# EAGLE design Nodo_univ (EAGLE 6.5.0)
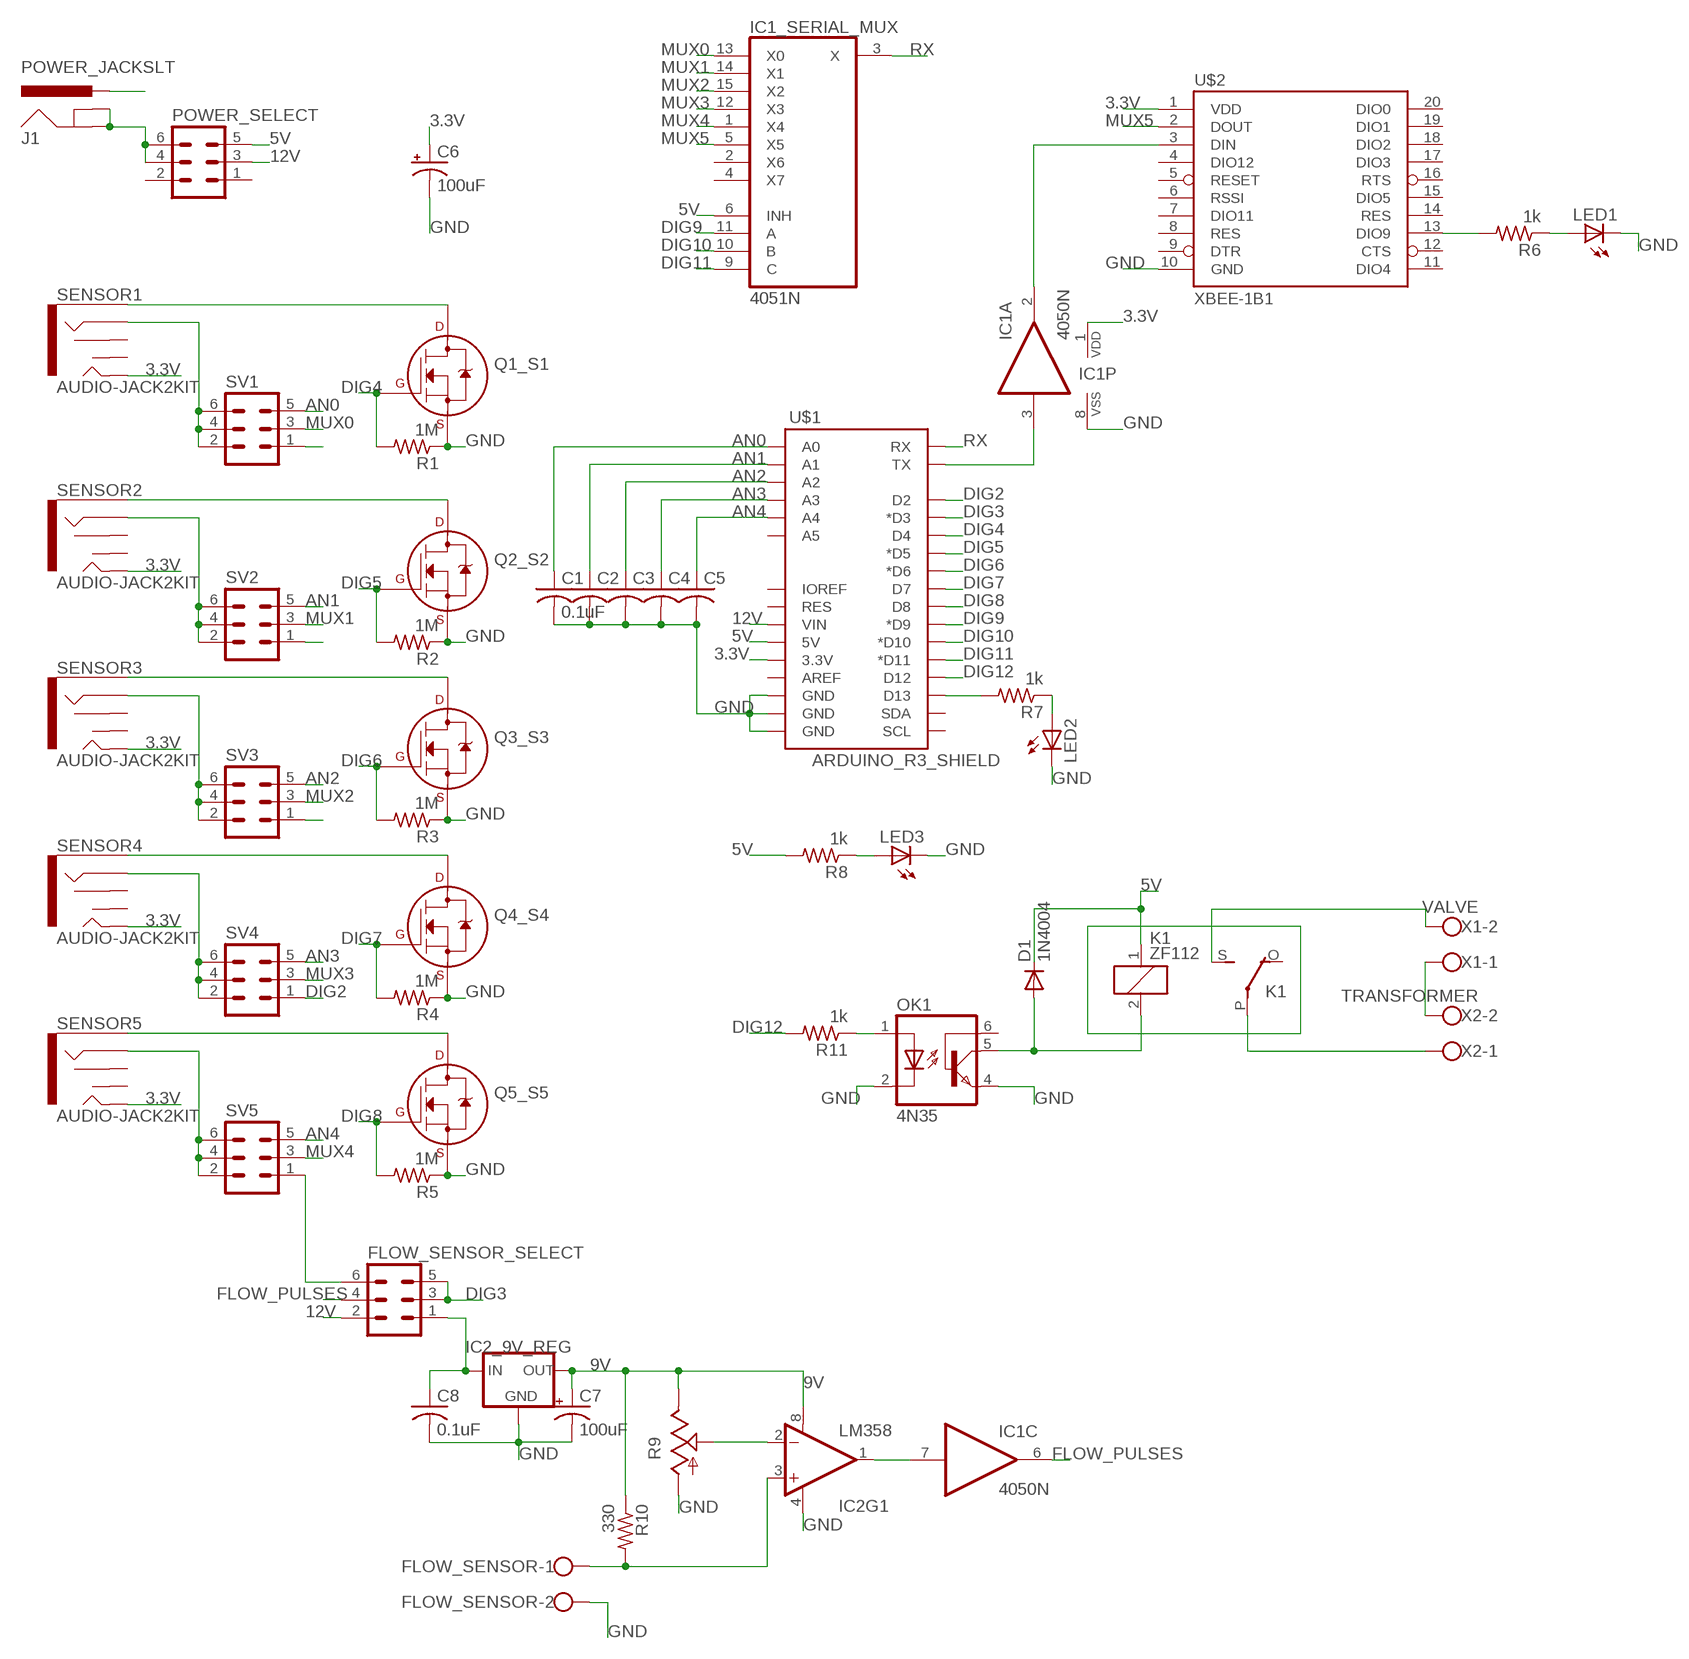
[diagram p0: schematic, sheet 1]

## Parts
C1  0.1uF  C-US025-025X050  [C025-025X050]
C2  C-US025-025X050  [C025-025X050]
C3  C-US025-025X050  [C025-025X050]
C4  C-US025-025X050  [C025-025X050]
C5  C-US025-025X050  [C025-025X050]
C6  100uF  CAP_POLPTH1  [CPOL-RADIAL-100UF-25V]
C7  100uF  CAP_POLPTH1  [CPOL-RADIAL-100UF-25V]
C8  0.1uF  C-US025-025X050  [C025-025X050]
D1  1N4004  [DO41-10]
FLOW_SENSOR  W237-102  [W237-102]
FLOW_SENSOR_SELECT  MA03-2  [MA03-2]
IC1  4050N  [DIL16]
IC1_SERIAL_MUX  4051N  [DIL16]
IC2  LM358  [DIP08]
IC2_9V_REG  78XXL  [78XXL]
J1  POWER_JACKSLT  [POWER_JACK_SLOT]
K1  ZF112  [ZF112]
LED1  LED3MM  [LED3MM]
LED2  LED3MM  [LED3MM]
LED3  LED3MM  [LED3MM]
OK1  4N35  [DIL06]
POWER_SELECT  MA03-2  [MA03-2]
Q1_S1  2N7000_TO92  [TO-92]
Q2_S2  2N7000_TO92  [TO-92]
Q3_S3  2N7000_TO92  [TO-92]
Q4_S4  2N7000_TO92  [TO-92]
Q5_S5  2N7000_TO92  [TO-92]
R1  1M  R-US_0207/10  [0207/10]
R2  1M  R-US_0207/10  [0207/10]
R3  1M  R-US_0207/10  [0207/10]
R4  1M  R-US_0207/10  [0207/10]
R5  1M  R-US_0207/10  [0207/10]
R6  1k  R-US_0207/10  [0207/10]
R7  1k  R-US_0207/10  [0207/10]
R8  1k  R-US_0207/10  [0207/10]
R9  TRIM_US-B64Y  [B64Y]
R10  330  R-US_0207/10  [0207/10]
R11  1k  R-US_0207/10  [0207/10]
SENSOR1  AUDIO-JACK2KIT  [AUDIO-JACK-KIT]
SENSOR2  AUDIO-JACK2KIT  [AUDIO-JACK-KIT]
SENSOR3  AUDIO-JACK2KIT  [AUDIO-JACK-KIT]
SENSOR4  AUDIO-JACK2KIT  [AUDIO-JACK-KIT]
SENSOR5  AUDIO-JACK2KIT  [AUDIO-JACK-KIT]
SV1  MA03-2  [MA03-2]
SV2  MA03-2  [MA03-2]
SV3  MA03-2  [MA03-2]
SV4  MA03-2  [MA03-2]
SV5  MA03-2  [MA03-2]
U$1  ARDUINO_R3_SHIELD  [UNO_R3_SHIELD]
U$2  XBEE-1B1  [XBEE-1]
X1  VALVE  W237-102  [W237-102]
X2  TRANSFORMER  W237-102  [W237-102]

## Nets
3.3V: C6.1(+) IC1.1(P:VDD) SENSOR1.TIP SENSOR2.TIP SENSOR3.TIP SENSOR4.TIP SENSOR5.TIP U$1.3.3V U$2.1(VDD)
5V: D1.C IC1_SERIAL_MUX.6(INH) K1.1 POWER_SELECT.5 R8.2 U$1.5V
9V: C7.1(+) IC2.8(V+) IC2_9V_REG.OUT R9.E R10.1
12V: FLOW_SENSOR_SELECT.2 POWER_SELECT.3 U$1.VIN
AN0: C1.1 SV1.5 U$1.A0
AN1: C2.1 SV2.5 U$1.A1
AN2: C3.1 SV3.5 U$1.A2
AN3: C4.1 SV4.5 U$1.A3
AN4: C5.1 SV5.5 U$1.A4
DIG2: SV4.1 U$1.D2
DIG3: FLOW_SENSOR_SELECT.3 FLOW_SENSOR_SELECT.5 U$1.D3(*D3)
DIG4: Q1_S1.2(G) R1.2 U$1.D4
DIG5: Q2_S2.2(G) R2.2 U$1.D5(*D5)
DIG6: Q3_S3.2(G) R3.2 U$1.D6(*D6)
DIG7: Q4_S4.2(G) R4.2 U$1.D7
DIG8: Q5_S5.2(G) R5.2 U$1.D8
DIG9: IC1_SERIAL_MUX.11(A) U$1.D9(*D9)
DIG10: IC1_SERIAL_MUX.10(B) U$1.D10(*D10)
DIG11: IC1_SERIAL_MUX.9(C) U$1.D11(*D11)
DIG12: R11.2 U$1.D12
FLOW_PULSES: FLOW_SENSOR_SELECT.4 IC1.6(C:O)
GND: C1.2 C2.2 C3.2 C4.2 C5.2 C6.2(-) C7.2(-) C8.2 FLOW_SENSOR.2 IC1.8(P:VSS) IC2.4(V-) IC2_9V_REG.GND J1.PWR LED1.K(C) LED2.K(C) LED3.K(C) OK1.2(C) OK1.4(EMI) Q1_S1.1(S) Q2_S2.1(S) Q3_S3.1(S) Q4_S4.1(S) Q5_S5.1(S) R1.1 R2.1 R3.1 R4.1 R5.1 R9.A U$1.GND@0(GND) U$1.GND@1(GND) U$1.GND@2(GND) U$2.10(GND)
MUX0: IC1_SERIAL_MUX.13(X0) SV1.3
MUX1: IC1_SERIAL_MUX.14(X1) SV2.3
MUX2: IC1_SERIAL_MUX.15(X2) SV3.3
MUX3: IC1_SERIAL_MUX.12(X3) SV4.3
MUX4: IC1_SERIAL_MUX.1(X4) SV5.3
MUX5: IC1_SERIAL_MUX.5(X5) U$2.2(DOUT)
N$1: Q1_S1.3(D) SENSOR1.SLEEVE
N$2: Q2_S2.3(D) SENSOR2.SLEEVE
N$3: Q3_S3.3(D) SENSOR3.SLEEVE
N$4: Q4_S4.3(D) SENSOR4.SLEEVE
N$5: Q5_S5.3(D) SENSOR5.SLEEVE
N$6: SENSOR1.RING SV1.2 SV1.4 SV1.6
N$7: SENSOR2.RING SV2.2 SV2.4 SV2.6
N$8: SENSOR3.RING SV3.2 SV3.4 SV3.6
N$9: SENSOR4.RING SV4.2 SV4.4 SV4.6
N$10: SENSOR5.RING SV5.2 SV5.4 SV5.6
N$11: FLOW_SENSOR_SELECT.6 SV5.1
N$12: IC1.3(A:I) U$1.TX
N$13: SV1.1
N$14: IC1.2(A:O) U$2.3(DIN)
N$15: R6.2 U$2.13(DIO9)
N$16: SV2.1
N$17: LED1.A R6.1
N$18: R7.2 U$1.D13
N$19: SV3.1
N$20: LED2.A R7.1
N$21: C8.1 FLOW_SENSOR_SELECT.1 IC2_9V_REG.IN
N$22: IC2.2(-IN) R9.S
N$23: LED3.A R8.1
N$24: J1.GND@1(GNDBREAK) J1.GND@2(GND) POWER_SELECT.4 POWER_SELECT.6
N$25: IC1.7(C:I) IC2.1(OUT)
N$26: FLOW_SENSOR.1 IC2.3(+IN) R10.2
N$27: OK1.1(A) R11.1
N$29: D1.A K1.2 OK1.5(COL)
N$30: X1.1 X2.2
N$31: K1.P(2:P) X2.1
N$32: K1.S(2:S) X1.2
RX: IC1_SERIAL_MUX.3(X) U$1.RX
Unconnected: IC1.4(B:O) IC1.5(B:I) IC1.9(D:I) IC1.10(D:O) IC1.11(E:I) IC1.12(E:O) IC1.14(F:I) IC1.15(F:O) IC1_SERIAL_MUX.2(X6) IC1_SERIAL_MUX.4(X7) IC2.5(+IN) IC2.6(-IN) IC2.7(OUT) K1.O(2:O) OK1.6(BAS) POWER_SELECT.1 POWER_SELECT.2 SENSOR1.RSH SENSOR1.TSH SENSOR2.RSH SENSOR2.TSH SENSOR3.RSH SENSOR3.TSH SENSOR4.RSH SENSOR4.TSH SENSOR5.RSH SENSOR5.TSH U$1.A5 U$1.AREF U$1.IOREF U$1.RES U$1.SCL U$1.SDA U$2.4(DIO12) U$2.5(RESET) U$2.6(RSSI) U$2.7(DIO11) U$2.8(RES) U$2.9(DTR) U$2.11(DIO4) U$2.12(CTS) U$2.14(RES) U$2.15(DIO5) U$2.16(RTS) U$2.17(DIO3) U$2.18(DIO2) U$2.19(DIO1) U$2.20(DIO0)

## Power pins joined to a net without a drawn wire
GND: IC1_SERIAL_MUX.8(GND)
VCC: IC1_SERIAL_MUX.16(VCC)
VEE: IC1_SERIAL_MUX.7(VEE)

## Library data of the parts
C1-C5 C8 = resistor:C-US: CAPACITOR, American symbol
C6 C7 = SparkFun-Capacitors:CAP_POL: Capacitor Polarized These are standard SMD and PTH capacitors. Normally 10uF, 47uF, and 100uF in electrolytic and tantalum varieties. Always verify the external diameter of the through hole cap, it varies with capacity, voltage, and manufacturer. The EIA devices should be standard.
D1 = diode:1N4004: DIODE general purpose rectifier, 1 A
FLOW_SENSOR X1 X2 = con-wago-500:W237-102: WAGO SCREW CLAMP; MPN: 237-102; OC_FARNELL: unknown; OC_NEWARK: 70K9898
FLOW_SENSOR_SELECT POWER_SELECT SV1-SV5 = con-lstb:MA03-2: PIN HEADER; OC_FARNELL: unknown; OC_NEWARK: unknown
IC1 = 40xx:4050: Hex non-inverting BUFFER
IC1_SERIAL_MUX = 40xx:4051: 8-channel ANALOG MULTIPLEXER
IC2 = SparkFun-AnalogIC:LM358: Jellybean op-amp; PROD_ID: IC-09172
IC2_9V_REG = v-reg:78XXL: VOLTAGE REGULATOR
J1 = SparkFun-Connectors:POWER_JACK: Power Jack This is the standard 5.5mm barrel jack for power. The PTH is the most common, proven, reliable, footprint. The Slot footprint only works if the mill layer is transmitted to the PCB fab house so be warned. Mating wall wart : TOL-00298 (and others); PROD_ID: PRT-00119
K1 = relay:ZF112: RELAY 1 x switch; OC_FARNELL: unknown; OC_NEWARK: unknown
LED1-LED3 = led:LED: LED OSRAM: - CHIPLED LG R971, LG N971, LY N971, LG Q971, LY Q971, LO R971, LY R971 LH N974, LH R974 LS Q976, LO Q976, LY Q976 LO Q996 - Hyper CHIPLED LW Q18S LB Q993, LB Q99A, LB R99A - SideLED LS A670, LO A670, LY A670, LG A670, LP A670 LB A673, LV A673, LT A673, LW A673 LH A674 LY A675 LS A676, LA A676, LO A676, LY A676, LW A676 LS A679, LY A679, LG A679 - Hyper Micro SIDELED® LS Y876, LA Y876, LO Y876, LY Y876 LT Y87S - SmartLED LW L88C, LW L88S LB L89C, LB L89S, LG L890 LS L89K, LO L89K, LY L89K LS L896, LA L896, LO L896, LY L896 - TOPLED LS T670, LO T670, LY T670, LG T670, LP T670 LSG T670, LSP T670, LSY T670, LOP T670, LYG T670 LG T671, LOG T671, LSG T671 LB T673, LV T673, LT T673, LW T673 LH T674 LS T676, LA T676, LO T676, LY T676, LB T676, LH T676, LSB T676, LW T676 LB T67C, LV T67C, LT T67C, LS T67K, LO T67K, LY T67K, LW E67C LS E67B, LA E67B, LO E67B, LY E67B, LB E67C, LV E67C, LT E67C LW T67C LS T679, LY T679, LG T679 LS T770, LO T770, LY T770, LG T770, LP T770 LB T773, LV T773, LT T773, LW T773 LH T774 LS E675, LA E675, LY E675, LS T675 LS T776, LA T776, LO T776, LY T776, LB T776 LHGB T686 LT T68C, LB T68C - Hyper Mini TOPLED® LB M676 - Mini TOPLED Santana® LG M470 LS M47K, LO M47K, LY M47K Source: http://www.osram.convergy.de LUXEON: - LUMILED® LXK2-PW12-R00, LXK2-PW12-S00, LXK2-PW14-U00, LXK2-PW14-V00 LXK2-PM12-R00, LXK2-PM12-S00, LXK2-PM14-U00 LXK2-PE12-Q00, LXK2-PE12-R00, LXK2-PE12-S00, LXK2-PE14-T00, LXK2-PE14-U00 LXK2-PB12-K00, LXK2-PB12-L00, LXK2-PB12-M00, LXK2-PB14-N00, LXK2-PB14-P00, LXK2-PB14-Q00 LXK2-PR12-L00, LXK2-PR12-M00, LXK2-PR14-Q00, LXK2-PR14-R00 LXK2-PD12-Q00, LXK2-PD12-R00, LXK2-PD12-S00 LXK2-PH12-R00, LXK2-PH12-S00 LXK2-PL12-P00, LXK2-PL12-Q00, LXK2-PL12-R00 Source: www.luxeon.com KINGBRIGHT: KA-3528ASYC Source: www.kingbright.com
OK1 = optocoupler:4N35: MOTOROLA OPTO COUPLER; MF: FAIRCHILD SEMICONDUCTOR; MPN: 4N35; OC_FARNELL: 1328375; OC_NEWARK: 72K9946
Q1_S1 Q2_S2 Q3_S3 Q4_S4 Q5_S5 = transistors:2N700*: 2N7000, 2N7002, NDS7002A N-channel enhancement mode MOSFET
R1-R8 R10 R11 = resistor:R-US_: RESISTOR, American symbol
R9 = pot:TRIM_US-: POTENTIOMETER
SENSOR1-SENSOR5 = SparkFun-Connectors:AUDIO-JACK2: Stereo audio jack with bypass switches. SMT version used on LilyPad MP3 board.; PROD_ID: CONN-08774
U$1 = SparkFun-Boards:ARDUINO_R3_SHIELD: Shield form compatible with the Arduino Uno R3.
U$2 = SparkFun-RF:XBEE-1: Xbee module footprints SMT header is CONN-09042.

## Board
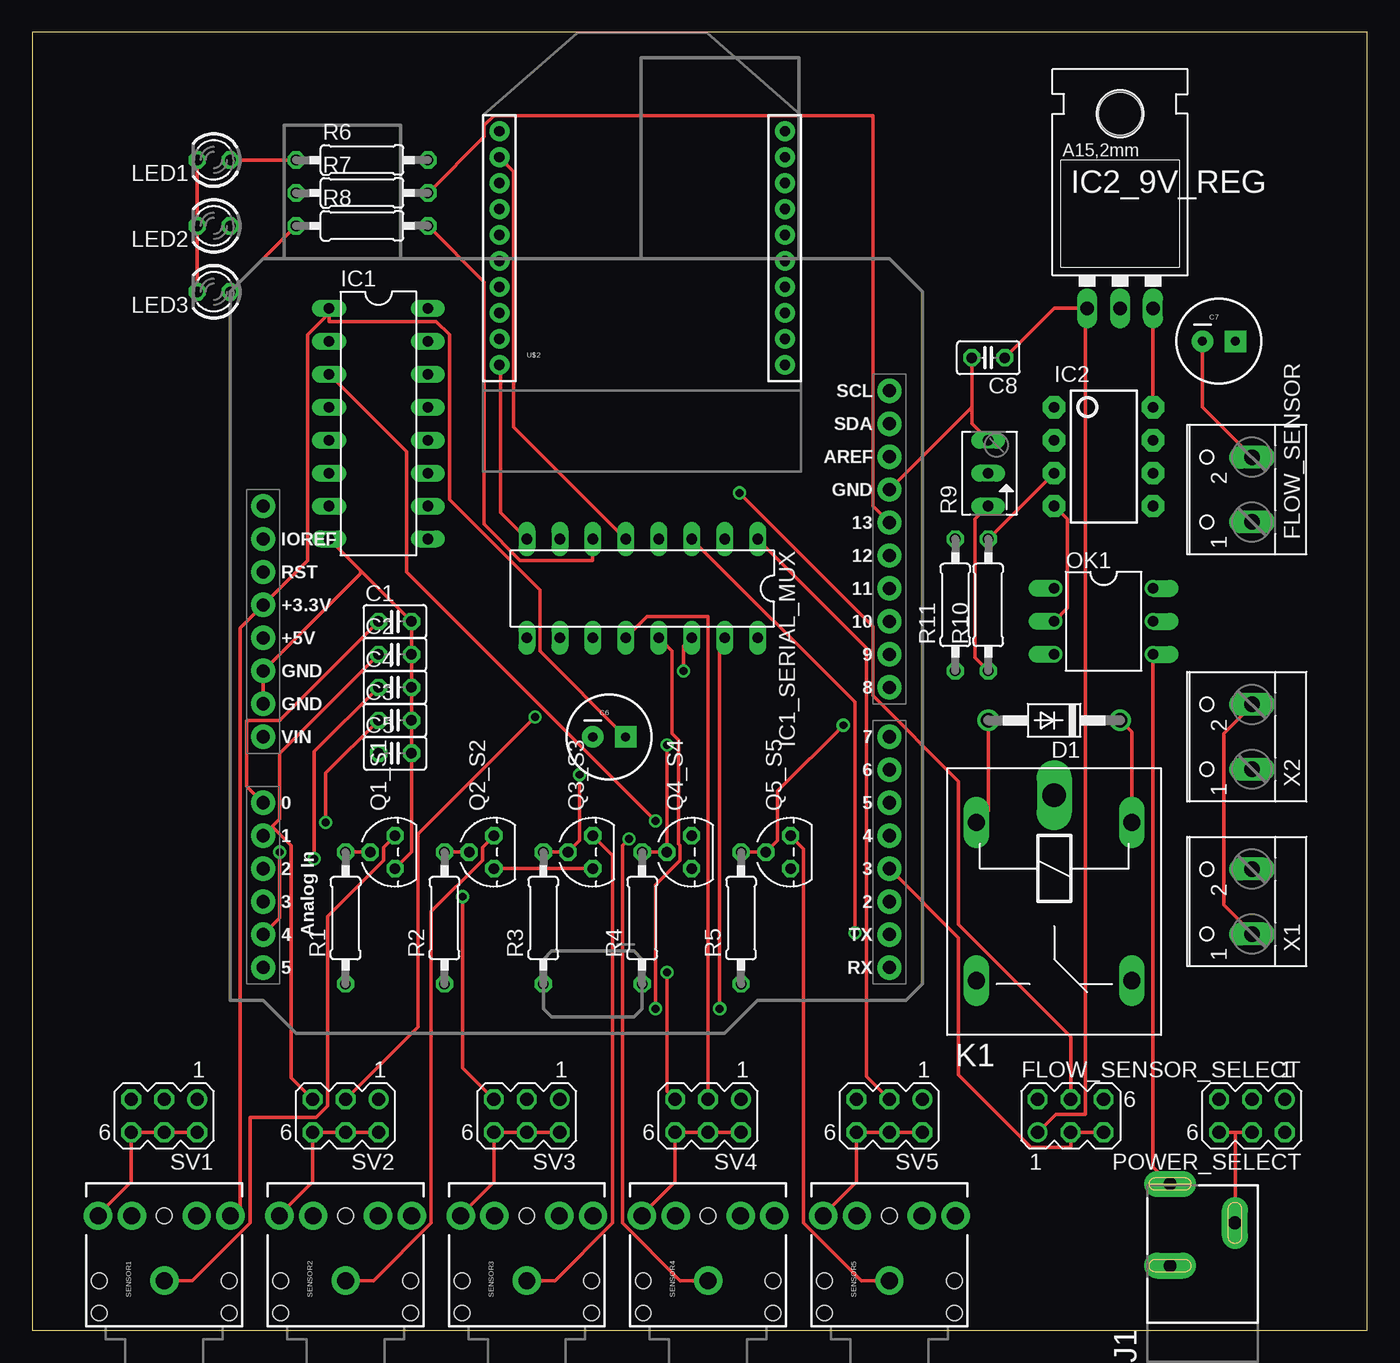
[diagram p1: board, top side]
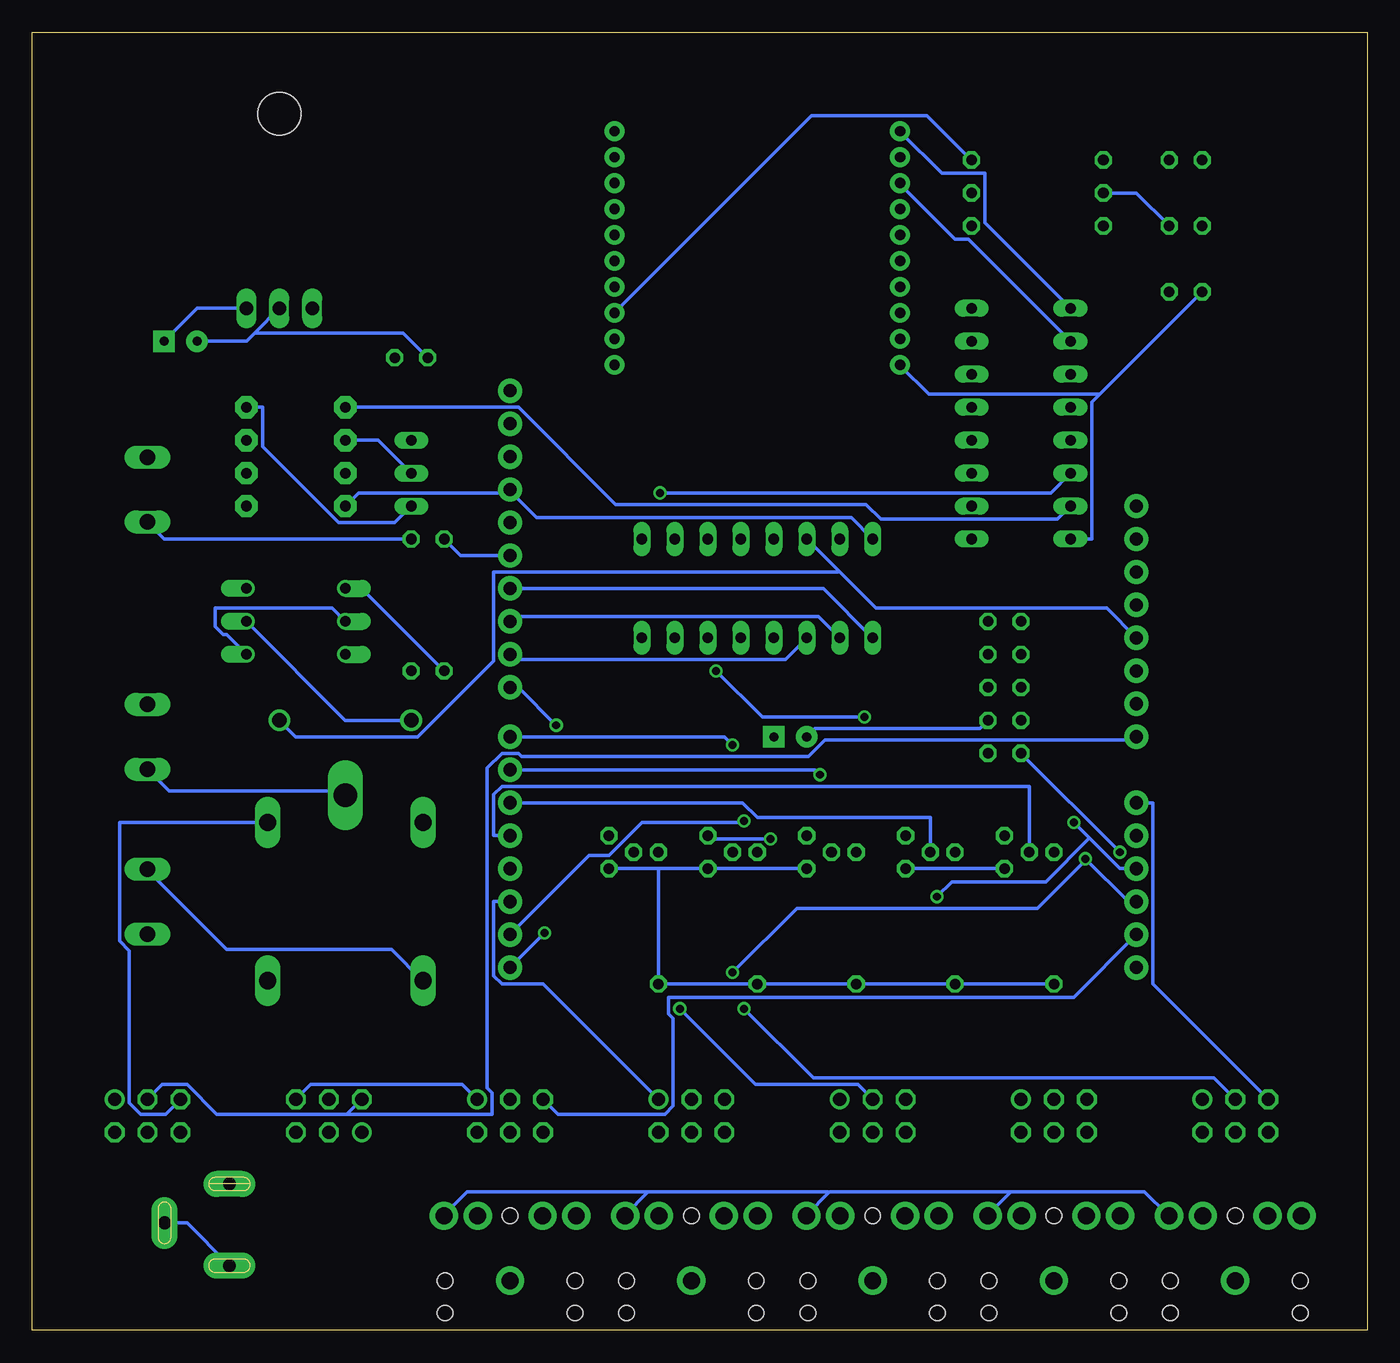
[diagram p2: board, bottom side, seen from below]

Size 102.85 x 100 mm. Coordinates in mm from the lower left corner, seen from the top.
Outline: 0,0 102.85,0 102.85,100 0,100 0,0
Copper layers (1*16): Top 0.035mm / dielectric 1.5mm / Bottom 0.035mm
Design rules "default": minimum track width 10mil, minimum drill 24mil, track to track 8mil, track to pad 8mil, pad to pad 8mil, via to via 8mil, smd to smd 8mil, copper to edge 40mil, drill to drill 8mil, minimum pad ring 10mil, minimum via ring 8mil, stop-mask expansion 4mil, vias tented up to drill 0mil, thermal gap 10mil

### Footprints (pad centres in the part's own frame; a part is rotated, then mirrored left to right if it is on the bottom)
C025-025X050 = drill 0.813 octagon: 1 -1.27,0; 2 1.27,0
CPOL-RADIAL-100UF-25V = drill 0.7 pad 1.651 square: 1 1.27,0 | drill 0.7 pad 1.651: 2 -1.27,0
DO41-10 = drill 1.118: A 5.08,0; C -5.08,0
W237-102 = drill 1.194 long: 1 -2.5,-1.27; 2 2.5,-1.27
MA03-2 = drill 1.016: 1 -2.54,-1.27 | drill 1.016 octagon: 2 -2.54,1.27; 3 0,-1.27; 4 0,1.27; 5 2.54,-1.27; 6 2.54,1.27
DIL16 = drill 0.813 long: 1 -8.89,-3.81; 2 -6.35,-3.81; 3 -3.81,-3.81; 4 -1.27,-3.81; 5 1.27,-3.81; 6 3.81,-3.81; 7 6.35,-3.81; 8 8.89,-3.81; 9 8.89,3.81; 10 6.35,3.81; 11 3.81,3.81; 12 1.27,3.81; 13 -1.27,3.81; 14 -3.81,3.81; 15 -6.35,3.81; 16 -8.89,3.81
DIP08 = drill 0.813 pad 1.727 octagon: 1 -3.81,-3.81; 2 -1.27,-3.81; 3 1.27,-3.81; 4 3.81,-3.81; 5 3.81,3.81; 6 1.27,3.81; 7 -1.27,3.81; 8 -3.81,3.81
78XXL = drill 1.016 long: GND 0,-3.81; IN -2.54,-3.81; OUT 2.54,-3.81 | hole 3.302: 0,11.176
POWER_JACK_SLOT = drill 1 pad 2 long: GND@1 2.58,7.5; GND@2 7.58,10.8; PWR 2.58,13.8
ZF112 = drill 1.321 long: 1 -6.096,5.994; 2 -6.096,-5.994; O 6.096,5.994; S 6.096,-5.994 | drill 1.803 long: P -8.204,0
LED3MM = drill 0.813 octagon: A -1.27,0; K 1.27,0
DIL06 = drill 0.813 offset: 1 -2.54,-3.81; 2 0,-3.81; 3 2.54,-3.81; 4 2.54,3.81; 5 0,3.81; 6 -2.54,3.81
TO-92 = drill 0.813 octagon: 1 -1.27,0; 2 0,1.905; 3 1.27,0
0207/10 = drill 0.813 octagon: 1 -5.08,0; 2 5.08,0
B64Y = drill 0.813 long: A 2.54,0; E -2.54,0; S 0,0
AUDIO-JACK-KIT = drill 1.3 pad 2.184: RING 5,5.1; RSH 5,2.5; SLEEVE 0,0; TIP 5,-5.1; TSH 5,-2.5 | hole 1.2: 0,5; -2.5,5; -2.5,-5; 0,-5; 5,0
UNO_R3_SHIELD = drill 1.016 pad 1.88: 3.3V 50.8,26.67; 5V 50.8,29.21; A0 50.8,41.91; A1 50.8,44.45; A2 50.8,46.99; A3 50.8,49.53; A4 50.8,52.07; A5 50.8,54.61; AREF 2.54,15.24; D2 2.54,49.53; D3 2.54,46.99; D4 2.54,44.45; D5 2.54,41.91; D6 2.54,39.37; D7 2.54,36.83; D8 2.54,33.02; D9 2.54,30.48; D10 2.54,27.94; D11 2.54,25.4; D12 2.54,22.86; D13 2.54,20.32; GND@0 50.8,31.75; GND@1 50.8,34.29; GND@2 2.54,17.78; IOREF 50.8,21.59; NC 50.8,19.05; RES 50.8,24.13; RX 2.54,54.61; SCL 2.54,10.16; SDA 2.54,12.7; TX 2.54,52.07; VIN 50.8,36.83
XBEE-1 = drill 0.8 pad 1.524: 1 -11,20; 2 -11,18; 3 -11,16; 4 -11,14; 5 -11,12; 6 -11,10; 7 -11,8; 8 -11,6; 9 -11,4; 10 -11,2; 11 11,2; 12 11,4; 13 11,6; 14 11,8; 15 11,10; 16 11,12; 17 11,14; 18 11,16; 19 11,18; 20 11,20

### Placement (x,y rotation side)
C1  27.94,54.61 0 top
C2  27.94,52.07 0 top
C3  27.94,46.99 0 top
C4  27.94,49.53 0 top
C5  27.94,44.45 0 top
C6  44.45,45.72 0 top
C7  91.44,76.2 0 top
C8  73.66,74.93 180 top
D1  78.74,46.99 180 top
FLOW_SENSOR  92.71,64.77 90 top
FLOW_SENSOR_SELECT  80.01,16.51 0 top
IC1  26.67,69.85 270 top
IC1_SERIAL_MUX  46.99,57.15 180 top
IC2  82.55,67.31 270 top
IC2_9V_REG  83.82,82.55 0 top
J1  85.09,-2.54 0 top
K1  78.74,33.02 270 top
LED1  13.97,90.17 180 top
LED2  13.97,85.09 180 top
LED3  13.97,80.01 180 top
OK1  82.55,54.61 270 top
POWER_SELECT  93.98,16.51 180 top
Q1_S1  27.94,36.83 90 top
Q2_S2  35.56,36.83 90 top
Q3_S3  43.18,36.83 90 top
Q4_S4  50.8,36.83 90 top
Q5_S5  58.42,36.83 90 top
R1  24.13,31.75 90 top
R2  31.75,31.75 90 top
R3  39.37,31.75 90 top
R4  46.99,31.75 90 top
R5  54.61,31.75 90 top
R6  25.4,90.17 0 top
R7  25.4,87.63 0 top
R8  25.4,85.09 0 top
R9  73.66,66.04 90 top
R10  73.66,55.88 90 top
R11  71.12,55.88 90 top
SENSOR1  10.16,3.81 90 top
SENSOR2  24.13,3.81 90 top
SENSOR3  38.1,3.81 90 top
SENSOR4  52.07,3.81 90 top
SENSOR5  66.04,3.81 90 top
SV1  10.16,16.51 180 top
SV2  24.13,16.51 180 top
SV3  38.1,16.51 180 top
SV4  52.07,16.51 180 top
SV5  66.04,16.51 180 top
U$1  68.58,82.55 180 top
U$2  46.99,72.39 0 top
X1  92.71,33.02 90 top
X2  92.71,45.72 90 top

### Tracks (layer width: path | path; a pad name or v marks a point on that pad's centre or on a via)
3.3V
  Top 0.254: C6.1 39.12,52.32 39.12,57.02 32.13,64.01 32.13,76.71 31.12,77.72 22.86,77.72 22.86,78.36 | 22.86,78.36 21.21,76.71 21.21,59.31 U$1.3.3V 16,54.1 16,9.53 15.37,8.89 SENSOR1.TIP | 22.86,78.36 IC1.1
  Bottom 0.254: 27.5,10.6 29.21,8.89 SENSOR2.TIP | 27.5,10.6 27.43,10.67 17.14,10.67 15.37,8.89 SENSOR1.TIP | 41.47,10.6 41.4,10.67 27.56,10.67 27.5,10.6 | 41.47,10.6 43.18,8.89 SENSOR3.TIP | 55.44,10.6 55.37,10.67 41.53,10.67 41.47,10.6 | 55.44,10.6 57.15,8.89 SENSOR4.TIP | SENSOR5.TIP 71.12,8.89 69.34,10.67 55.5,10.67 55.44,10.6 | IC1.1 29.46,85.34 29.46,89.15 32.77,89.15 35.94,92.33 U$2.1
5V
  Top 0.254: D1.C 84.71,46.1 84.71,39.12 K1.1 | R8.2 34.8,80.77 34.8,62.1 37.59,59.31 43.18,59.31 IC1_SERIAL_MUX.6
  Bottom 0.254: POWER_SELECT.5 92.58,16.64 94.49,16.64 95.38,17.53 95.38,29.21 96.14,29.97 96.14,39.12 K1.1 | 40.7,58.48 37.85,55.63 20.07,55.63 U$1.5V | 40.7,58.48 IC1_SERIAL_MUX.6 | D1.C 82.55,45.72 73.15,45.72 67.31,51.56 67.31,58.42 40.77,58.42 40.7,58.48
9V
  Top 0.254: R10.1 72.64,51.82 72.64,62.48 R9.E | IC2.8 IC2_9V_REG.OUT
  Bottom 0.254: C7.1 90.17,78.74 IC2_9V_REG.OUT | R9.E 74.93,62.23 79.25,62.23 85.09,68.07 85.09,71.12 IC2.8
12V
  Bottom 0.254: 78.55,16.7 78.61,16.64 88.65,16.64 90.93,18.92 92.84,18.92 POWER_SELECT.3 | 78.55,16.7 FLOW_SENSOR_SELECT.2 | U$1.VIN 18.03,45.47 41.78,45.47 43.05,44.2 65.15,44.2 65.41,44.45 66.67,44.45 67.82,43.31 67.82,18.67 67.44,18.29 67.44,16.64 78.49,16.64 78.55,16.7
AN0
  Top 0.254: C1.1 19.05,46.99 16.51,46.99 16.51,41.91 U$1.A0
  Bottom 0.254: SV1.5 16.51,26.67 16.51,40.64 U$1.A0
AN1
  Top 0.254: C2.1 19.05,44.45 19.05,39.37 18.48,38.8 | U$1.A1 18.48,38.8 | SV2.5 19.94,19.43 19.94,37.34 18.48,38.8
AN2  (via drill 0.61)
  Top 0.254: C3.1 22.61,42.93 v22.61,39.12 | SV3.5 33.15,20.19 v33.15,33.4
  Bottom 0.254: 21.4,37.91 19.05,35.56 U$1.A2 | 21.4,37.91 v22.61,39.12 | v33.15,33.4 32,34.54 24.77,34.54 21.4,37.91
AN3  (via drill 0.61)
  Top 0.254: C4.1 21.72,44.58 v21.72,36.32 | SV4.5 48.89,18.41 v48.89,27.56
  Bottom 0.254: U$1.A3 18.41,33.02 v21.72,36.32 21.72,36.2 25.4,32.51 43.94,32.51 v48.89,27.56
AN4  (via drill 0.61)
  Top 0.254: v19.05,36.83 19.05,31.75 U$1.A4
  Bottom 0.254: v19.05,36.83 C5.1 | SV5.5 62.36,16.64 54.1,16.64 53.47,17.27 53.47,24 53.85,24.38 53.85,25.65 22.61,25.65 U$1.A4
DIG2
  Bottom 0.254: SV4.1 63.5,26.67 66.67,26.67 67.31,27.3 67.31,33.02 U$1.D2
DIG3
  Top 0.254: FLOW_SENSOR_SELECT.5 FLOW_SENSOR_SELECT.3 80.01,14.1 76.96,14.1 71.37,19.68 71.37,30.23 U$1.D3
DIG4
  Top 0.254: Q1_S1.2 R1.2
  Bottom 0.254: Q1_S1.2 26.04,41.91 66.67,41.91 67.31,41.27 67.31,38.1 U$1.D4
DIG5
  Top 0.254: Q2_S2.2 R2.2
  Bottom 0.254: Q2_S2.2 33.66,39.5 46.99,39.5 48.13,40.64 U$1.D5
DIG6  (via drill 0.61)
  Top 0.254: R3.2 Q3_S3.2 42.16,37.72 v42.16,42.8
  Bottom 0.254: v42.16,42.8 42.54,43.18 U$1.D6
DIG7  (via drill 0.61)
  Top 0.254: R4.2 Q4_S4.2 v48.89,45.09
  Bottom 0.254: v48.89,45.09 49.53,45.72 U$1.D7
DIG8  (via drill 0.61)
  Top 0.254: R5.2 Q5_S5.2 57.4,37.72 57.4,41.53 v62.48,46.61
  Bottom 0.254: v62.48,46.61 65.41,49.53 U$1.D8
DIG9
  Bottom 0.254: IC1_SERIAL_MUX.11 44.83,51.69 65.66,51.69 U$1.D9
DIG10
  Bottom 0.254: IC1_SERIAL_MUX.10 42.29,54.99 65.66,54.99 U$1.D10
DIG11
  Bottom 0.254: IC1_SERIAL_MUX.9 41.91,57.15 U$1.D11
DIG12
  Bottom 0.254: R11.2 69.85,59.69 U$1.D12
FLOW_PULSES  (via drill 0.61)
  Top 0.254: v54.48,64.52 64.77,54.23 64.77,48.9 71.37,42.29 71.37,31.24 80.01,22.61 FLOW_SENSOR_SELECT.4
  Bottom 0.254: IC1.6 24.38,64.52 v54.48,64.52
GND
  Top 0.254: R9.A 72.39,69.85 72.39,71.12 | C8.2 72.39,71.12 | 72.39,71.12 U$1.GND@2 | C7.2 90.17,71.12 93.98,67.31 FLOW_SENSOR.2 | OK1.2 79.76,55.63 79.76,62.48 IC2.4 | OK1.4 86.36,12.57 87.63,11.3 J1.PWR | Q2_S2.1 Q3_S3.1 | IC1_SERIAL_MUX.8 36.07,62.99 36.07,74.3 U$2.10 | LED3.K LED2.K LED1.K | U$1.GND@1 U$1.GND@0 25.27,58.29 25.27,58.42 25.34,58.48 | 25.34,58.48 C1.2 C2.2 C4.2 C3.2 C5.2 29.21,36.83 Q1_S1.1 | 25.34,58.48 IC1.8
  Bottom 0.254: 85.66,76.9 86.36,76.2 C7.2 | 85.66,76.9 IC2_9V_REG.GND | C8.2 74.3,76.83 85.6,76.83 85.66,76.9 | OK1.4 87.88,53.59 88.14,53.59 88.77,54.23 88.77,55.63 79.76,55.63 OK1.2 | IC2.4 77.72,64.52 66.29,64.52 U$1.GND@2 66.04,64.64 64.01,62.61 39.75,62.61 IC1_SERIAL_MUX.8 | R1.1 R2.1 R3.1 R4.1 R5.1 54.61,35.56 | Q2_S2.1 Q1_S1.1 | Q3_S3.1 Q4_S4.1 54.61,35.56 | 54.61,35.56 Q5_S5.1 | C6.2 42.54,46.35 29.85,46.35 C3.2 | 20.64,72.07 21.21,71.5 21.21,60.96 IC1.8 | 20.64,72.07 LED3.K | U$2.10 35.94,74.3 33.78,72.14 20.7,72.14 20.64,72.07
MUX0  (via drill 0.61)
  Top 0.254: IC1_SERIAL_MUX.13 49.28,52.32 49.28,45.97 49.78,45.47 49.78,37.47 49.91,37.34 49.91,36.2 48.01,34.29 v48.01,24.77
  Bottom 0.254: v48.01,24.77 42.67,19.43 11.81,19.43 SV1.3
MUX1  (via drill 0.61)
  Top 0.254: IC1_SERIAL_MUX.14 50.16,52.7 v50.16,50.8 | v38.73,47.24 29.72,38.23 29.72,23.37 SV2.3
  Bottom 0.254: v50.16,50.8 46.61,47.24 v38.73,47.24
MUX2  (via drill 0.61)
  Top 0.254: IC1_SERIAL_MUX.15 52.96,52.96 v52.96,24.77
  Bottom 0.254: v52.96,24.77 47.12,18.92 39.24,18.92 SV3.3
MUX3
  Top 0.254: IC1_SERIAL_MUX.12 47.37,54.99 52.07,54.99 SV4.3
MUX4
  Top 0.254: IC1_SERIAL_MUX.1 64.26,52.58 64.26,19.56 SV5.3
MUX5
  Top 0.254: IC1_SERIAL_MUX.5 37.08,69.6 37.08,89.28 36.07,90.3 U$2.2
N$1
  Top 0.254: Q1_S1.3 27.05,37.21 27.05,36.2 22.73,31.88 22.73,17.27 21.84,16.38 16.76,16.38 16.76,8.26 12.32,3.81 SENSOR1.SLEEVE
N$2
  Top 0.254: Q2_S2.3 34.67,37.21 34.67,36.2 30.73,32.26 30.73,8.26 26.29,3.81 SENSOR2.SLEEVE
N$3
  Top 0.254: Q3_S3.3 44.7,36.58 44.7,8.26 40.26,3.81 SENSOR3.SLEEVE
N$4  (via drill 0.61)
  Top 0.254: v45.97,37.85 45.47,37.34 45.47,8.26 49.91,3.81 SENSOR4.SLEEVE
  Bottom 0.254: Q4_S4.3 50.55,37.85 v45.97,37.85
N$5
  Top 0.254: Q5_S5.3 59.44,37.08 59.44,8.26 63.88,3.81 SENSOR5.SLEEVE
N$6
  Top 0.254: SV1.2 SV1.4 SV1.6 7.62,11.43 5.08,8.89 SENSOR1.RING
N$7
  Top 0.254: SV2.2 SV2.4 SV2.6 21.59,11.43 19.05,8.89 SENSOR2.RING
N$8
  Top 0.254: SV3.2 SV3.4 SV3.6 35.56,11.43 33.02,8.89 SENSOR3.RING
N$9
  Top 0.254: SV4.2 SV4.4 SV4.6 49.53,11.43 46.99,8.89 SENSOR4.RING
N$10
  Top 0.254: SV5.2 SV5.4 SV5.6 63.5,11.43 60.96,8.89 SENSOR5.RING
N$11
  Bottom 0.254: SV5.1 69.72,18.92 81.41,18.92 FLOW_SENSOR_SELECT.6
N$12  (via drill 0.61)
  Top 0.254: IC1.3 28.83,67.69 28.83,58.42 v48.01,39.24
  Bottom 0.254: v48.01,39.24 48.13,39.12 55.88,39.12 58.42,36.58 59.94,36.58 U$1.TX
N$14
  Bottom 0.254: IC1.2 30.73,84.07 31.75,84.07 35.94,88.27 U$2.3
N$15
  Bottom 0.254: R6.2 33.91,93.6 42.8,93.6 57.91,78.49 U$2.13
N$17
  Top 0.254: R6.1 LED1.A
N$18
  Top 0.254: R7.2 34.8,91.95 34.8,92.84 35.56,93.6 64.77,93.6 64.77,63.5 U$1.D13
N$20
  Bottom 0.254: LED2.A 17.78,87.63 R7.1
N$21
  Top 0.254: C8.1 78.74,78.74 81.15,78.74 | FLOW_SENSOR_SELECT.1 78.87,16.64 81.15,16.64 81.15,78.74 | 81.15,78.74 IC2_9V_REG.IN
N$22
  Bottom 0.254: R9.S 76.2,68.58 IC2.2
N$23
  Top 0.254: R8.1 LED3.A
N$24
  Top 0.254: POWER_SELECT.4 92.71,15.24 | 92.71,15.24 POWER_SELECT.6 | 92.71,15.24 92.71,8.38 J1.GND@2
  Bottom 0.254: J1.GND@1 87.76,5.08 90.93,8.26 92.58,8.26 J1.GND@2
N$25
  Bottom 0.254: IC1.7 23.88,62.48 37.46,62.48 38.61,63.63 57.91,63.63 65.41,71.12 IC2.1
N$26
  Top 0.254: IC2.3 R10.2
  Bottom 0.254: R10.2 92.71,60.96 93.98,62.23 FLOW_SENSOR.1
N$27
  Bottom 0.254: R11.1 77.47,57.15 OK1.1
N$29
  Top 0.254: D1.A 73.66,40.01 72.77,39.12 K1.2
  Bottom 0.254: OK1.5 78.74,46.99 D1.A
N$30
  Top 0.254: X1.1 93.98,30.61 91.82,32.77 91.82,45.97 93.98,48.13 X2.2
N$31
  Bottom 0.254: X2.1 93.98,43.18 92.33,41.53 78.99,41.53 78.74,41.27 K1.P
N$32
  Bottom 0.254: X1.2 93.98,35.43 87.88,29.34 75.18,29.34 72.77,26.92 K1.S
RX  (via drill 0.61)
  Top 0.254: IC1_SERIAL_MUX.3 63.37,48.39 v63.37,30.61
  Bottom 0.254: U$1.RX v63.37,30.61